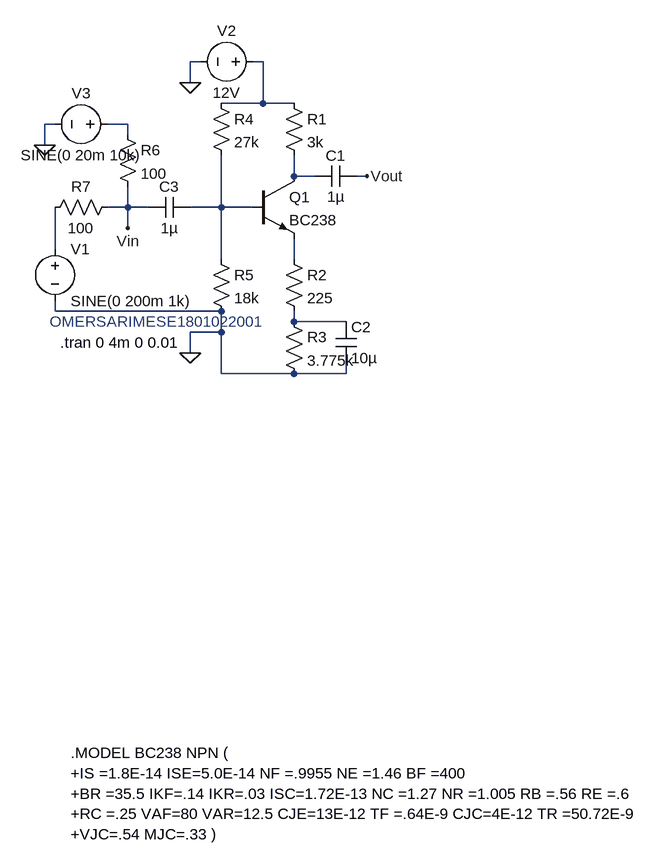
[diagram p0: schematic commonemitterAmp.asc]
commonemitterAmp.asc, the LTspice schematic file:
Version 4
SHEET 1 888 1144
WIRE 144 -48 128 -48
WIRE 240 -48 224 -48
WIRE 128 -16 128 -48
WIRE 240 16 240 -48
WIRE 240 16 176 16
WIRE 288 16 240 16
WIRE -80 48 -96 48
WIRE 32 48 0 48
WIRE 32 64 32 48
WIRE -96 80 -96 48
WIRE 288 128 288 96
WIRE 320 128 288 128
WIRE 400 128 384 128
WIRE 32 176 32 144
WIRE 32 176 0 176
WIRE 64 176 32 176
WIRE 176 176 176 96
WIRE 176 176 128 176
WIRE 224 176 176 176
WIRE 32 208 32 176
WIRE -80 240 -80 176
WIRE 176 256 176 176
WIRE 288 256 288 224
WIRE -80 336 -80 320
WIRE 176 336 -80 336
WIRE 288 352 288 336
WIRE 368 352 288 352
WIRE 176 368 176 336
WIRE 176 368 128 368
WIRE 128 400 128 368
WIRE 176 432 176 368
WIRE 288 432 176 432
WIRE 368 432 368 416
WIRE 368 432 288 432
FLAG 128 400 0
FLAG 128 -16 0
FLAG -96 80 0
FLAG 32 208 Vin
FLAG 400 128 Vout
SYMBOL npn 224 128 R0
SYMATTR InstName Q1
SYMATTR Value BC238
SYMBOL res 272 0 R0
SYMATTR InstName R1
SYMATTR Value 3k
SYMBOL res 272 240 R0
SYMATTR InstName R2
SYMATTR Value 225
SYMBOL cap 384 112 R90
WINDOW 0 0 32 VBottom 2
WINDOW 3 32 32 VTop 2
SYMATTR InstName C1
SYMATTR Value 1µ
SYMBOL res 272 336 R0
SYMATTR InstName R3
SYMATTR Value 3.775k
SYMBOL cap 352 352 R0
SYMATTR InstName C2
SYMATTR Value 10µ
SYMBOL res 160 0 R0
SYMATTR InstName R4
SYMATTR Value 27k
SYMBOL res 160 240 R0
SYMATTR InstName R5
SYMATTR Value 18k
SYMBOL cap 128 160 R90
WINDOW 0 0 32 VBottom 2
WINDOW 3 32 32 VTop 2
SYMATTR InstName C3
SYMATTR Value 1µ
SYMBOL res 16 48 R0
SYMATTR InstName R6
SYMATTR Value 100
SYMBOL res 16 160 R90
WINDOW 0 0 56 VBottom 2
WINDOW 3 32 56 VTop 2
SYMATTR InstName R7
SYMATTR Value 100
SYMBOL voltage -80 224 R0
WINDOW 123 0 0 Left 0
WINDOW 39 0 0 Left 0
SYMATTR InstName V1
SYMATTR Value SINE(0 200m 1k)
SYMBOL voltage 240 -48 R90
WINDOW 0 -32 56 VBottom 2
WINDOW 3 32 56 VTop 2
WINDOW 123 0 0 Left 0
WINDOW 39 0 0 Left 0
SYMATTR InstName V2
SYMATTR Value 12V
SYMBOL voltage 16 48 R90
WINDOW 0 -32 56 VBottom 2
WINDOW 3 32 56 VTop 2
WINDOW 123 0 0 Left 0
WINDOW 39 0 0 Left 0
SYMATTR InstName V3
SYMATTR Value SINE(0 20m 10k)
TEXT -56 1016 Left 2 !.MODEL BC238 NPN (\n+IS =1.8E-14 ISE=5.0E-14 NF =.9955 NE =1.46 BF =400\n+BR =35.5 IKF=.14 IKR=.03 ISC=1.72E-13 NC =1.27 NR =1.005 RB =.56 RE =.6\n+RC =.25 VAF=80 VAR=12.5 CJE=13E-12 TF =.64E-9 CJC=4E-12 TR =50.72E-9\n+VJC=.54 MJC=.33 )
TEXT -88 352 Left 2 ;OMERSARIMESE1801022001
TEXT -72 384 Left 2 !.tran 0 4m 0 0.01

The netlist it stands for:
* commonemitterAmp.asc
Q1 N003 N004 N006 0 BC238
R1 N001 N003 3k
R2 N006 N007 225
C1 Vout N003 1µ
R3 N007 0 3.775k
C2 N007 0 10µ
R4 N001 N004 27k
R5 N004 0 18k
C3 N004 Vin 1µ
R6 N002 Vin 100
R7 Vin N005 100
V1 N005 0 SINE(0 200m 1k)
V2 N001 0 12V
V3 N002 0 SINE(0 20m 10k)
.model NPN NPN
.model PNP PNP
.lib standard.bjt
.MODEL BC238 NPN (
+IS =1.8E-14 ISE=5.0E-14 NF =.9955 NE =1.46 BF =400
+BR =35.5 IKF=.14 IKR=.03 ISC=1.72E-13 NC =1.27 NR =1.005 RB =.56 RE =.6
+RC =.25 VAF=80 VAR=12.5 CJE=13E-12 TF =.64E-9 CJC=4E-12 TR =50.72E-9
+VJC=.54 MJC=.33 )
* OMERSARIMESE1801022001
.tran 0 4m 0 0.01
.backanno
.end